# EAGLE design ssslidar_v1.0_main_board (EAGLE 7.6.0)
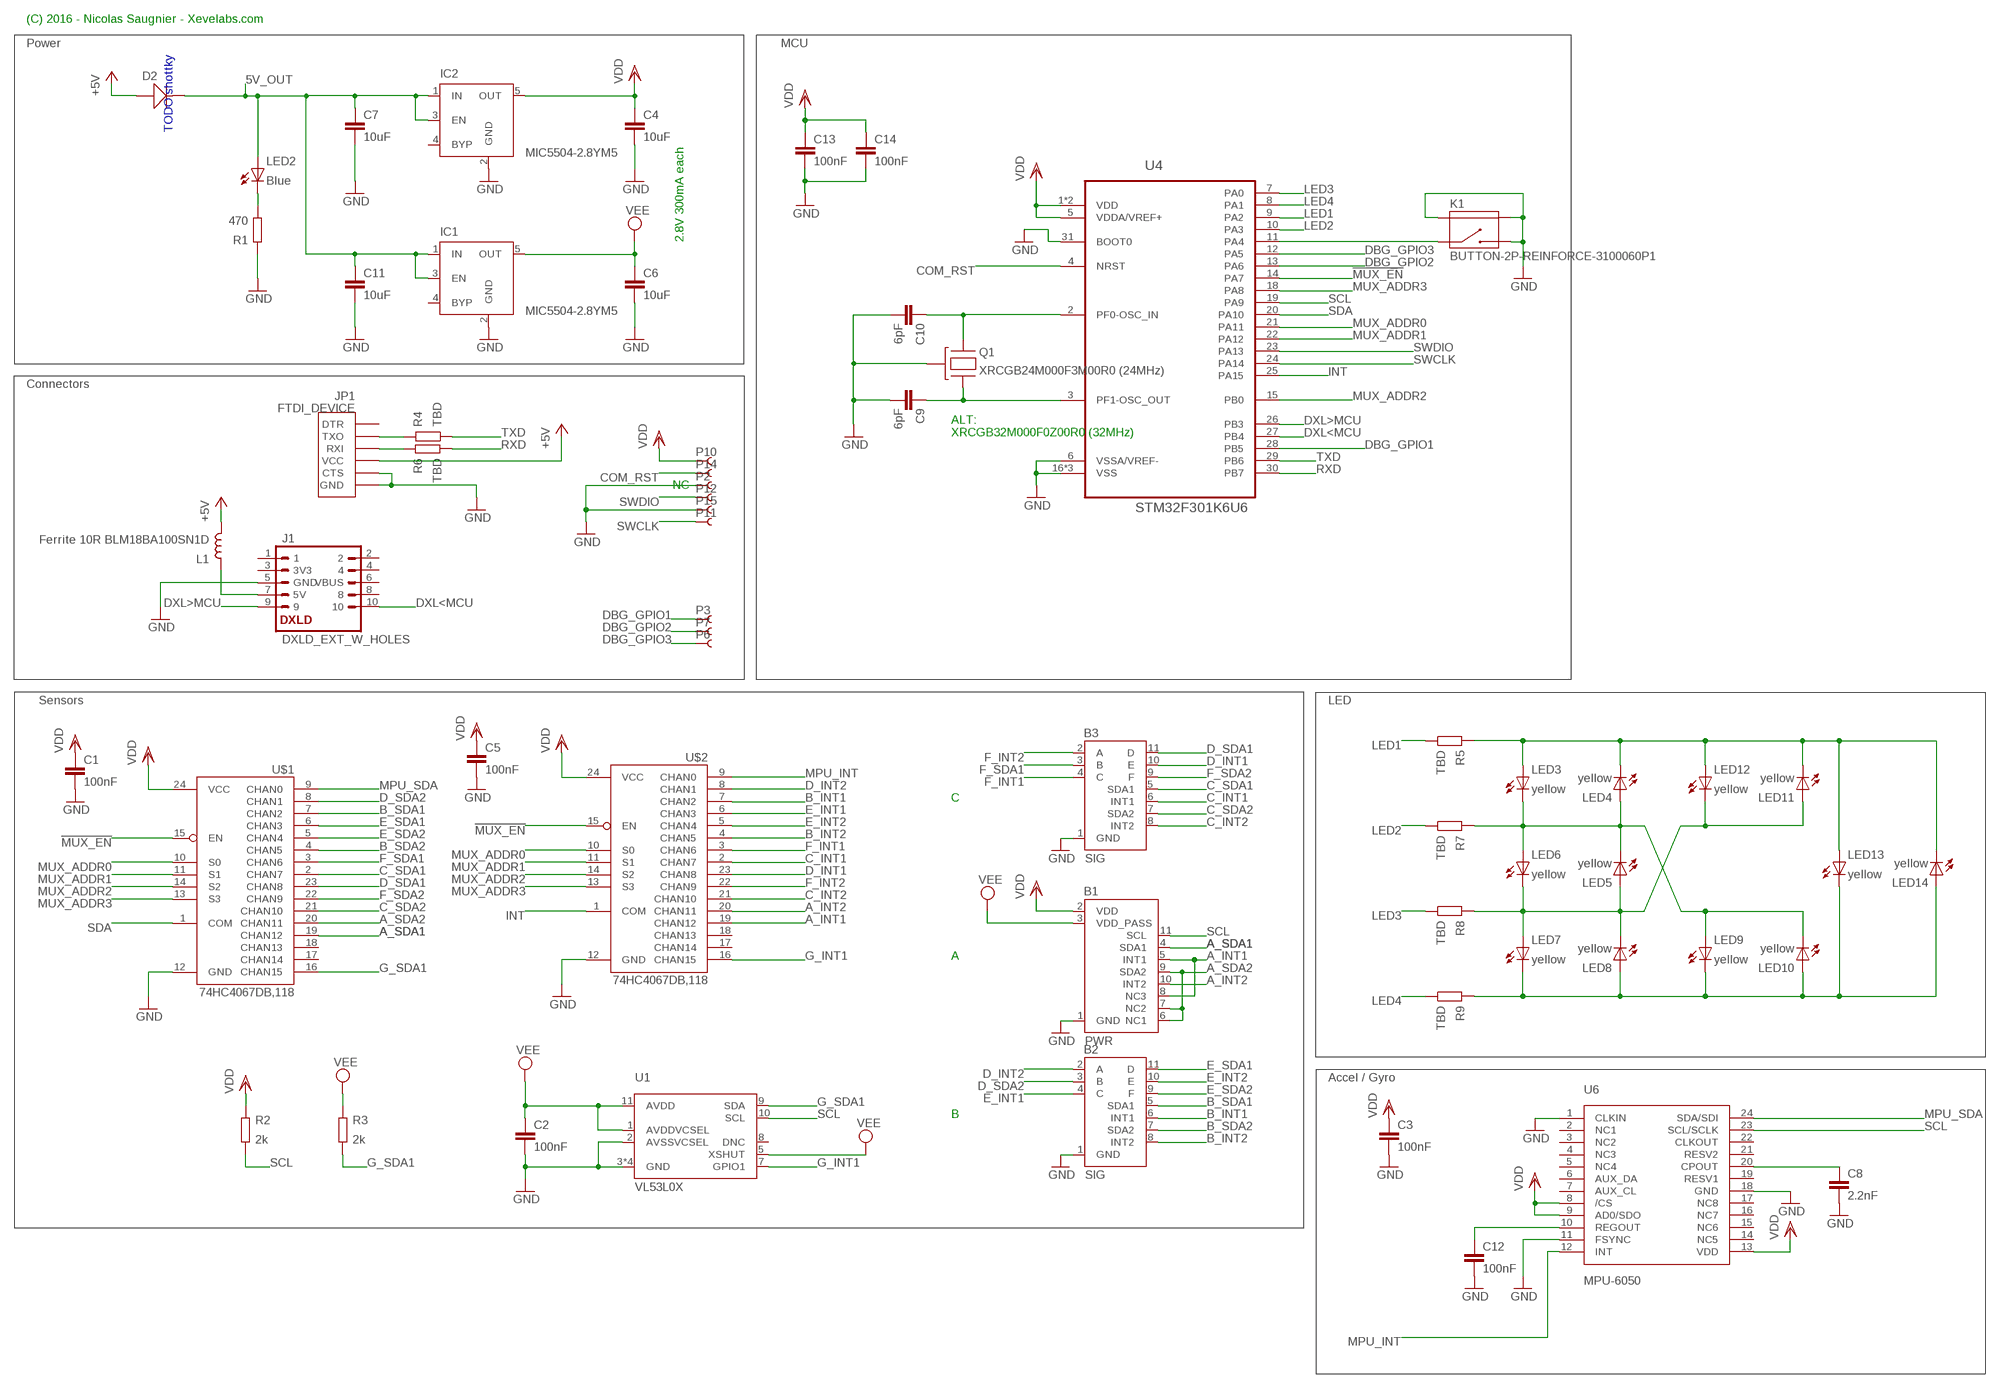
[diagram p0: schematic, sheet 1]

## Parts
B1  PWR  BLADE_PWR_BOTTOM  [BLADE]
B2  SIG  BLADE_SIG_BOTTOM  [BLADE]
B3  SIG  BLADE_SIG_BOTTOM  [BLADE]
C1  100nF  C0402  [0402_N]
C2  100nF  C0402  [0402_N]
C3  100nF  C0402  [0402_N]
C4  10uF  C0805  [0805_N]
C5  100nF  C0402  [0402_N]
C6  10uF  C0805  [0805_N]
C7  10uF  C0805  [0805_N]
C8  2.2nF  C0402  [0402_N]
C9  6pF  C0402  [0402_N]
C10  6pF  C0402  [0402_N]
C11  10uF  C0805  [0805_N]
C12  100nF  C0402  [0402_N]
C13  100nF  C0402  [0402_N]
C14  100nF  C0402  [0402_N]
D2  D-SOD-123  [SOD123]
IC1  MIC5504-2.8YM5  MIC5219XX  [SOT23-5]
IC2  MIC5504-2.8YM5  MIC5219XX  [SOT23-5]
J1  DXLD_EXT_W_HOLES  [DXLD_EXT_W_HOLES]
JP1  FTDI_DEVICE  [FTDI_DEVICE_SIDE]
K1  BUTTON-2P-REINFORCE-3100060P1  [4P-SMD-7.0X3.5X3.5H-90D]
L1  Ferrite 10R BLM18BA100SN1D  L0603  [0603_N]
LED2  Blue  LED0603  [D_0603_N]
LED3  yellow  LED0603  [D_0603_N]
LED4  yellow  LED0603  [D_0603_N]
LED5  yellow  LED0603  [D_0603_N]
LED6  yellow  LED0603  [D_0603_N]
LED7  yellow  LED0603  [D_0603_N]
LED8  yellow  LED0603  [D_0603_N]
LED9  yellow  LED0603  [D_0603_N]
LED10  yellow  LED0603  [D_0603_N]
LED11  yellow  LED0603  [D_0603_N]
LED12  yellow  LED0603  [D_0603_N]
LED13  yellow  LED0603  [D_0603_N]
LED14  yellow  LED0603  [D_0603_N]
P2  PIN_SMD_1X1.6  [PIN_SMD_1X1.6]
P3  PIN_SMD_1X1  [PIN_SMD_1X1]
P6  PIN_SMD_1X1  [PIN_SMD_1X1]
P7  PIN_SMD_1X1  [PIN_SMD_1X1]
P10  PIN_SMD_1X1.6  [PIN_SMD_1X1.6]
P11  PIN_SMD_1X1.6  [PIN_SMD_1X1.6]
P12  PIN_SMD_1X1.6  [PIN_SMD_1X1.6]
P14  PIN_SMD_1X1.6  [PIN_SMD_1X1.6]
P15  PIN_SMD_1X1.6  [PIN_SMD_1X1.6]
Q1  XRCGB24M000F3M00R0 (24MHz)  CRYSTAL_W/BODY-2.0X1.6  [CRYSTAL_2.0X1.6_4P]
R1  470  R0402  [0402_N]
R2  2k  R0402  [0402_N]
R3  2k  R0402  [0402_N]
R4  TBD  R0402  [0402_N]
R5  TBD  R0402  [0402_N]
R6  TBD  R0402  [0402_N]
R7  TBD  R0402  [0402_N]
R8  TBD  R0402  [0402_N]
R9  TBD  R0402  [0402_N]
U1  VL53L0X  [VL53L0X]
U4  STM32F301K6U6  [QFN50P500X500X60-33N]
U6  MPU-6050  MPU-6000  [QFN-24]
U$1  74HC4067DB,118  MUX-74HC4067SMD  [SSOP24]
U$2  74HC4067DB,118  MUX-74HC4067SMD  [SSOP24]

## Nets
5V_OUT: C7.1 C11.1 D2.- IC1.1(IN) IC1.3(EN) IC2.1(IN) IC2.3(EN) LED2.A
!MUX_EN: U4.14(PA7) U$1.15(EN) U$2.15(EN)
+5V: D2.+ JP1.P$4(VCC) L1.2
A_INT1: B1.5(INT1) B1.8(NC3) U$2.19(CHAN12)
A_INT2: B1.10(INT2) U$2.20(CHAN11)
A_SDA1: B1.4(SDA1) U$1.19(CHAN12)
A_SDA2: B1.6(NC1) B1.7(NC2) B1.9(SDA2) U$1.20(CHAN11)
B_INT1: B2.6(INT1) U$2.7(CHAN2)
B_INT2: B2.8(INT2) U$2.4(CHAN5)
B_SDA1: B2.5(SDA1) U$1.7(CHAN2)
B_SDA2: B2.7(SDA2) U$1.4(CHAN5)
C_INT1: B3.6(INT1) U$2.2(CHAN7)
C_INT2: B3.8(INT2) U$2.21(CHAN10)
C_SDA1: B3.5(SDA1) U$1.2(CHAN7)
C_SDA2: B3.7(SDA2) U$1.21(CHAN10)
COM_RST: P14.PIN U4.4(NRST)
D_INT1: B3.10(E) U$2.23(CHAN8)
D_INT2: B2.2(A) U$2.8(CHAN1)
D_SDA1: B3.11(D) U$1.23(CHAN8)
D_SDA2: B2.3(B) U$1.8(CHAN1)
DBG_GPIO1: P3.P$1 U4.28(PB5)
DBG_GPIO2: P7.P$1 U4.13(PA6)
DBG_GPIO3: P6.P$1 U4.12(PA5)
DXL<MCU: J1.10 U4.27(PB4)
DXL>MCU: J1.9 U4.26(PB3)
E_INT1: B2.4(C) U$2.6(CHAN3)
E_INT2: B2.10(E) U$2.5(CHAN4)
E_SDA1: B2.11(D) U$1.6(CHAN3)
E_SDA2: B2.9(F) U$1.5(CHAN4)
F_INT1: B3.4(C) U$2.3(CHAN6)
F_INT2: B3.2(A) U$2.22(CHAN9)
F_SDA1: B3.3(B) U$1.3(CHAN6)
F_SDA2: B3.9(F) U$1.22(CHAN9)
G_INT1: U1.7(GPIO1) U$2.16(CHAN15)
G_SDA1: R3.1 U1.9(SDA) U$1.16(CHAN15)
GND: B1.1(GND) B2.1(GND) B3.1(GND) C1.2 C2.2 C3.2 C4.2 C5.2 C6.2 C7.2 C8.2 C9.2 C10.2 C11.2 C12.2 C13.2 C14.2 IC1.2(GND) IC2.2(GND) J1.5(GND) JP1.P$5(CTS) JP1.P$6(GND) K1.2 K1.S1 K1.S2 P2.PIN P15.PIN Q1.2(GND) Q1.4(GND) R1.2 U1.2(AVSSVCSEL) U1.3(GND) U1.4(GND) U1.6(GND) U1.12(GND) U4.6(VSSA/VREF-) U4.16(VSS) U4.31(BOOT0) U4.32(VSS) U4.33(VSS) U6.1(CLKIN) U6.11(FSYNC) U6.18(GND) U$1.12(GND) U$2.12(GND)
INT: U4.25(PA15) U$2.1(COM)
LED1: R5.1 U4.9(PA2)
LED2: R7.1 U4.10(PA3)
LED3: R8.1 U4.7(PA0)
LED4: R9.1 U4.8(PA1)
MPU_INT: U6.12(INT) U$2.9(CHAN0)
MPU_SDA: U6.24(SDA/SDI) U$1.9(CHAN0)
MUX_ADDR0: U4.21(PA11) U$1.10(S0) U$2.10(S0)
MUX_ADDR1: U4.22(PA12) U$1.11(S1) U$2.11(S1)
MUX_ADDR2: U4.15(PB0) U$1.14(S2) U$2.14(S2)
MUX_ADDR3: U4.18(PA8) U$1.13(S3) U$2.13(S3)
N$1: C10.1 Q1.1 U4.2(PF0-OSC_IN)
N$2: C9.1 Q1.3 U4.3(PF1-OSC_OUT)
N$4: K1.1 U4.11(PA4)
N$5: J1.7(5V) L1.1
N$8: LED2.C R1.1
N$9: LED3.A LED4.C LED11.C LED12.A LED13.A LED14.C R5.2
N$10: LED3.C LED4.A LED5.C LED6.A LED9.A LED10.C R7.2
N$11: LED5.A LED6.C LED7.A LED8.C LED11.A LED12.C R8.2
N$12: LED7.C LED8.A LED9.C LED10.A LED13.C LED14.A R9.2
N$13: JP1.P$2(TXO) R4.2
N$14: JP1.P$3(RXI) R6.2
N$31: C12.1 U6.10(REGOUT)
N$33: C8.1 U6.20(CPOUT)
RXD: R6.1 U4.30(PB7)
SCL: B1.11(SCL) R2.1 U1.10(SCL) U4.19(PA9) U6.23(SCL/SCLK)
SDA: U4.20(PA10) U$1.1(COM)
SWCLK: P11.PIN U4.24(PA14)
SWDIO: P12.PIN U4.23(PA13)
TXD: R4.1 U4.29(PB6)
VDD: B1.2(VDD) C1.1 C3.1 C4.1 C5.1 C13.1 C14.1 IC2.5(OUT) P10.PIN R2.2 U4.1(VDD) U4.5(VDDA/VREF+) U4.17(VDD) U6.8(/CS) U6.9(AD0/SDO) U6.13(VDD) U$1.24(VCC) U$2.24(VCC)
VEE: B1.3(VDD_PASS) C2.1 C6.1 IC1.5(OUT) R3.2 U1.1(AVDDVCSEL) U1.5(XSHUT) U1.11(AVDD)
Unconnected: IC1.4(BYP) IC2.4(BYP) J1.1 J1.2 J1.3(3V3) J1.4 J1.6(VBUS) J1.8 JP1.P$1(DTR) U1.8(DNC) U6.2(NC1) U6.3(NC2) U6.4(NC3) U6.5(NC4) U6.6(AUX_DA) U6.7(AUX_CL) U6.14(NC5) U6.15(NC6) U6.16(NC7) U6.17(NC8) U6.19(RESV1) U6.21(RESV2) U6.22(CLKOUT) U$1.17(CHAN14) U$1.18(CHAN13) U$2.17(CHAN14) U$2.18(CHAN13)

## Notes on the sheet
- (C) 2016 - Nicolas Saugnier - Xevelabs.com
- Power | MCU
- TODO shottky
- 2.8V 300mA each
- Connectors
- ALT:
  XRCGB32M000F0Z00R0 (32MHz)
- NC
- Sensors | LED
- C
- A
- Accel / Gyro
- B

## Library data of the parts
B1 = ssslidar:BLADE_PWR_BOTTOM
B2 B3 = ssslidar:BLADE_SIG_BOTTOM
C1-C14 = Xevelabs:C: Non-polarized Capacitor
D2 = OPL:D*: DIODE
IC1 IC2 = v-reg-micrel:MIC5219XX: VOLTAGE REGULATOR; OC_FARNELL: unknown; OC_NEWARK: unknown
J1 = Xevelabs:DXLD_EXT
JP1 = SparkFun-Connectors:FTDI_DEVICE: Connector which mates to FTDI basic or FTDI cable.
K1 = OPL:BUTTON-2P-REINFORCE: TS-1188E http://www.best-dz.com/?thread-374-2.html SMD Button
L1 = Xevelabs:L
LED2-LED14 = Xevelabs:LED: LED
P2 P3 P6 P7 P10-P12 P14 P15 = Xevelabs:PIN
Q1 = Xevelabs:CRYSTAL_W/BODY: Crystal oscillator, with connection to the body.
R1-R9 = Xevelabs:R: Resistor
U1 = VL53L0X:VL53L0X: VL53L0X distance sensor
U4 = stm32F301:STM32F301K6U6: ARM-based 32-bit MCU,32UFQFN; MPN: STM32F050K4U6A; OC_FARNELL: 2115060; OC_NEWARK: 05W5798; PACKAGE: UFQFN-32; SUPPLIER: STMICROELECTRONICS
U6 = mpu6000:MPU-6000: Invensense MPU-6000: 3-axis gyro, 3-axis accel & 9-axis MotionFusion The MPU-60X0 Motion Processing Unit (MPU?) is the world?s first motion processing solution with integrated 9-axis sensor fusion for handset and tablet applications, game controllers, motion pointer remote controls, and other consumer devices. The MPU-60X0 has an embedded 3-axis MEMS gyroscope, 3-axis MEMS accelerometer and Digital Motion Processor? (DMP) hardware accelerator engine with an auxiliary I 2 C port that interfaces to third party digital sensors, such as magnetometers. Interfacing with a 3-axis magnetometer delivers a complete 9-axis sensor fusion output to the MPU?s primary I 2 C or SPI port. (SPI is available on MPU-6000 only). This combines acceleration and rotational motion plus heading information into a single data stream for the application; DATASHEET: http://invensense.com/mems/gyro/documents/PS-MPU-6000A-00_v1.0.pdf; LINK: http://invensense.com/mems/gyro/mpu6000.html; MFGPN: MPU-6000
U$1 U$2 = SparkFun-AnalogIC:MUX-74HC4067: 16-channel analog MUX

## Board
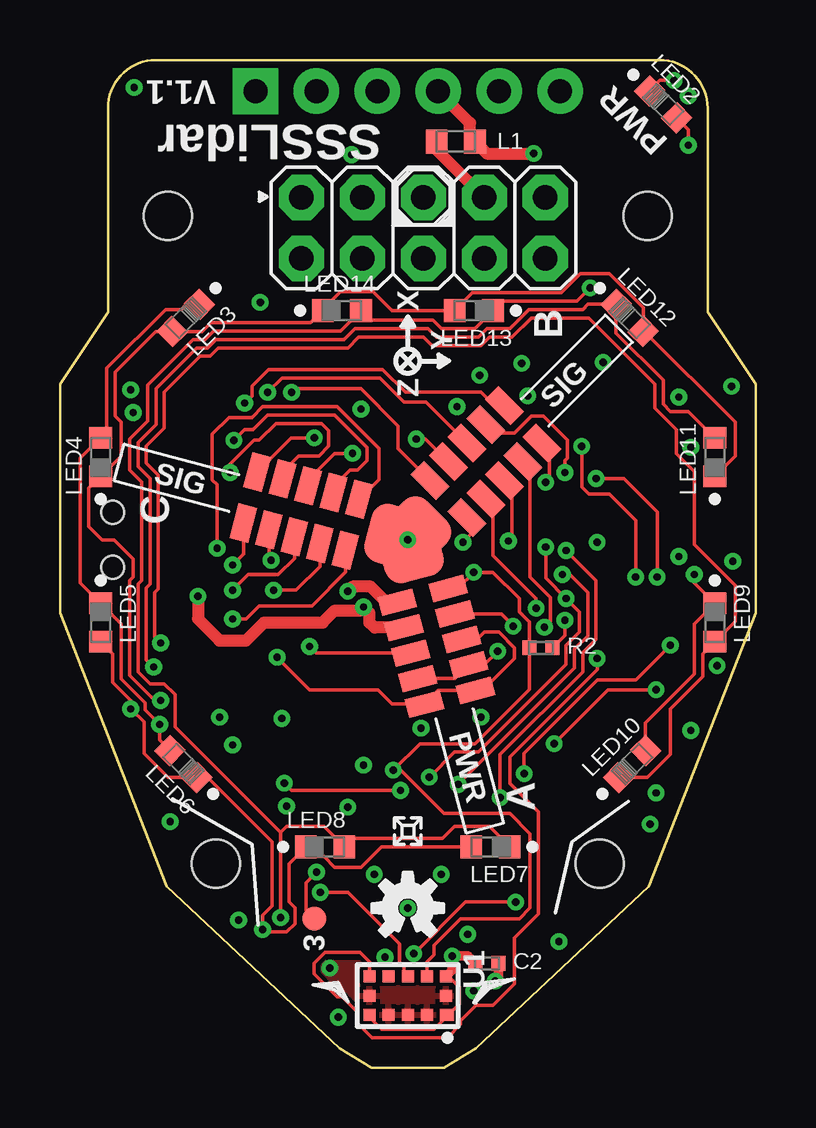
[diagram p1: board, top side]
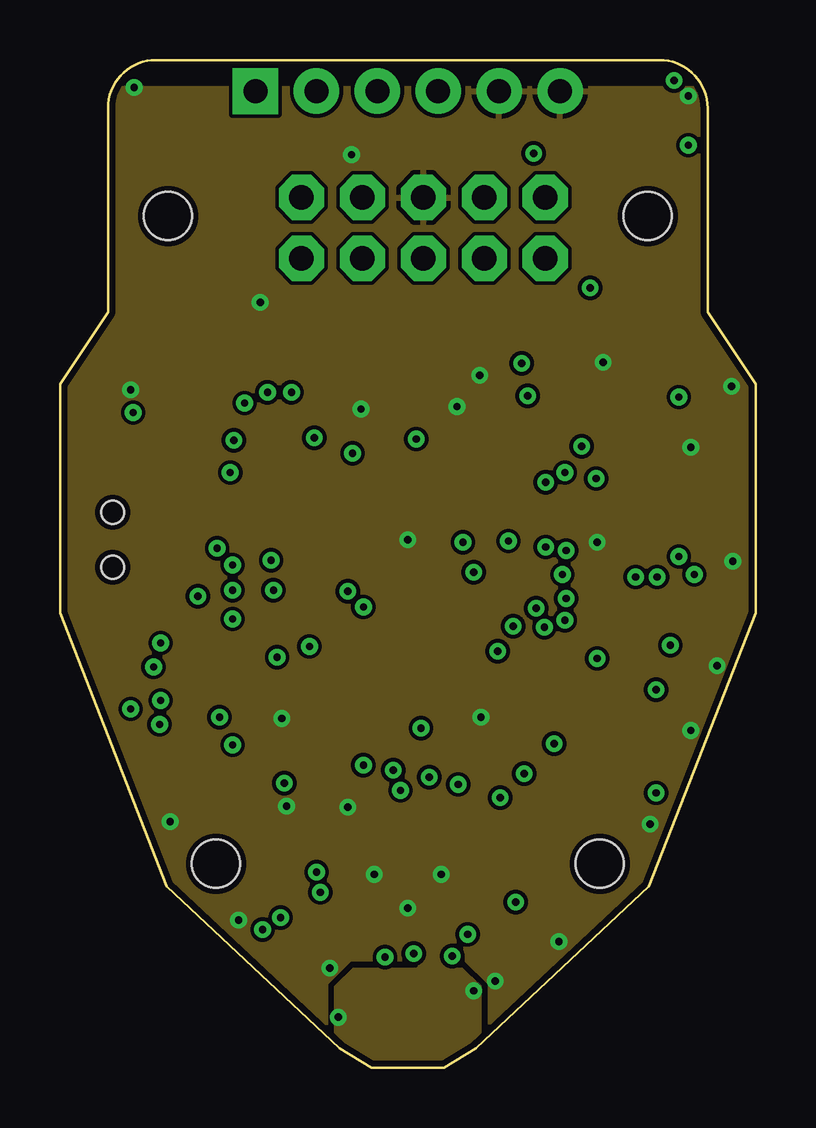
[diagram p2: board, inner layer Route2]
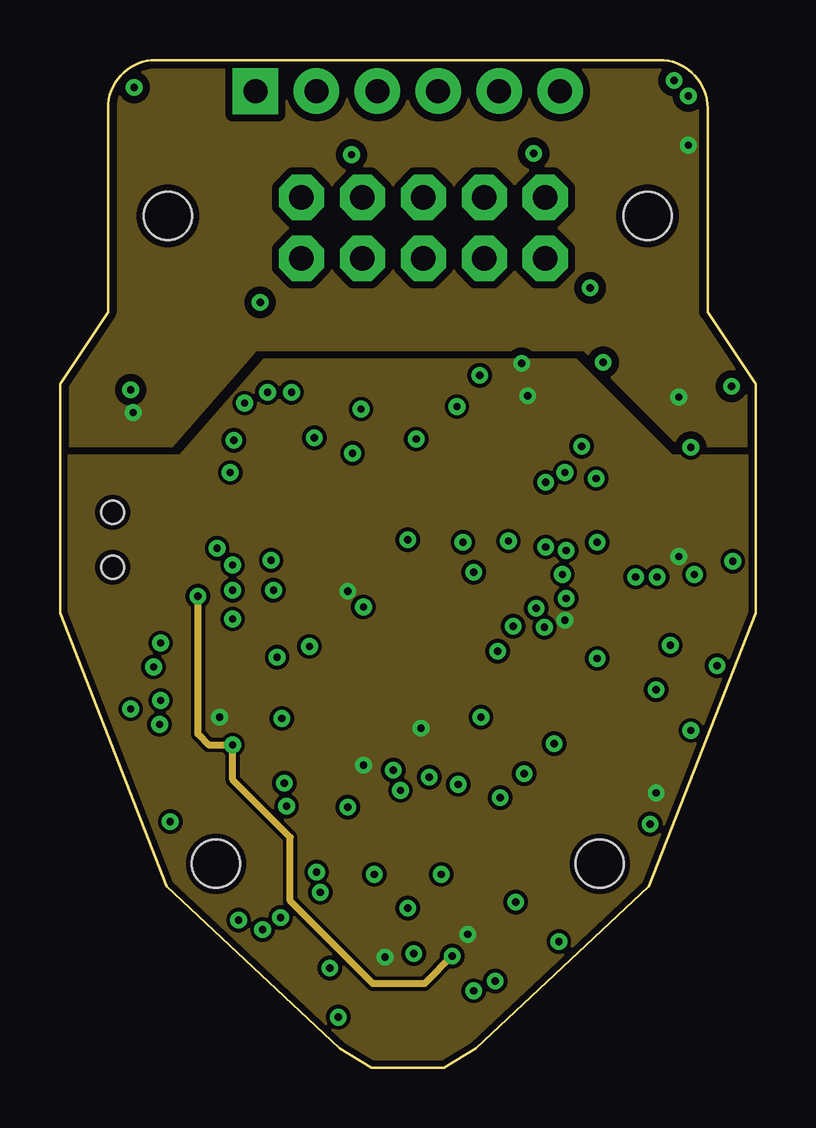
[diagram p3: board, inner layer Route3]
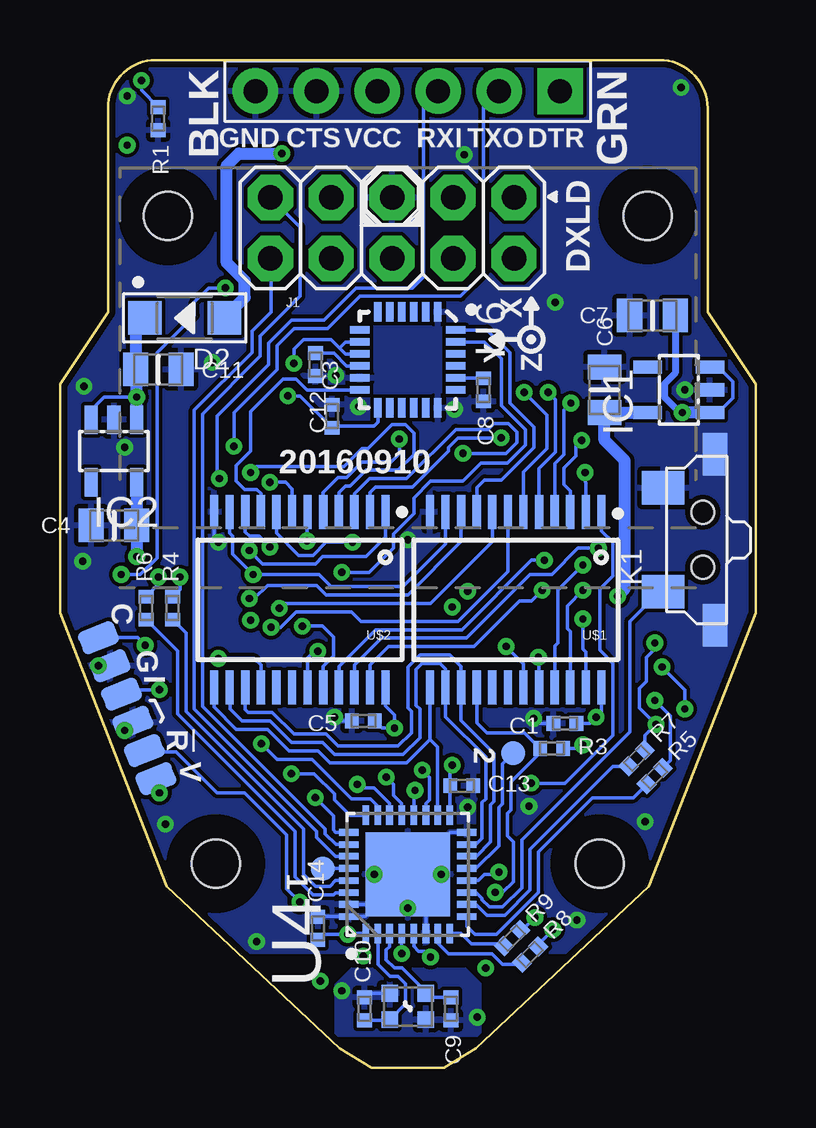
[diagram p4: board, bottom side, seen from below]

Size 29 x 42 mm. Coordinates in mm from the lower left corner, seen from the top.
Outline: 2,31.5 0,28.5 0,18.95 4.45,7.55 11.65,0.8 13,0 16,0 17.35,0.8 24.55,7.55 29,18.95 29,28.5 27,31.5 27,40 arc90 25,42 4,42 arc90 2,40 2,31.5
Copper layers (1*2*3*16): Top 0.035mm / dielectric 0.15mm / Route2 0.035mm / dielectric 1.1mm / Route3 0.035mm / dielectric 0.15mm / Bottom 0.035mm
Design rules "Xevelabs_6mil_4layers_eurocircuits *": minimum track width 0.15mm, minimum drill 0.25mm, track to track 0.155mm, track to pad 0.155mm, pad to pad 0.155mm, via to via 0.155mm, smd to smd 0mil, copper to edge 0.25mm, drill to drill 0.25mm, minimum pad ring 0.15mm, minimum via ring 0.2mm, stop-mask expansion 0mil, vias tented up to drill 100mil, thermal gap 0.2mm
Holes 2 mm at 6.5,8.5 22.5,8.5
tKeepout: area 4.5,6.5 to 8.5,10.5; area 20.5,6.5 to 24.5,10.5
bKeepout: area 3.5,5.5 to 9.5,11.5; area 19.5,5.5 to 25.5,11.5; area 1.5,32.5 to 7.5,38.5; area 21.5,32.5 to 27.5,38.5
bRestrict: area 22.5,33.5 to 26.5,37.5; area 4.5,6.5 to 8.5,10.5; area 20.5,6.5 to 24.5,10.5; area 2.5,33.5 to 6.5,37.5

### Footprints (pad centres in the part's own frame; a part is rotated, then mirrored left to right if it is on the bottom)
BLADE = smd 1.7 x 2.5: 1 0.85,0 | smd 0.8 x 1.5: 2 2.4,-1.1; 3 3.5,-1.1; 4 4.6,-1.1; 5 5.7,-1.1; 6 6.8,-1.1; 7 6.8,1.1; 8 5.7,1.1; 9 4.6,1.1; 10 3.5,1.1; 11 2.4,1.1
0402_N = smd 0.57 x 0.62: 1 -0.48,0; 2 0.48,0
0805_N = smd 1.05 x 1.4: 1 -0.95,0; 2 0.95,0
SOD123 = smd 1.397 x 1.397: + -1.651,0; - 1.651,0
SOT23-5 = smd 0.55 x 1.2: 1 -0.95,-1.3; 2 0,-1.3; 3 0.95,-1.3; 4 0.95,1.3; 5 -0.95,1.3
DXLD_EXT_W_HOLES = drill 1.016 pad 1.88 octagon: 1 -0.77,4.43; 2 1.77,4.43; 3 -0.77,1.89; 4 1.77,1.89; 5 -0.77,-0.65; 6 1.77,-0.65; 7 -0.77,-3.19; 8 1.77,-3.19; 9 -0.77,-5.73; 10 1.77,-5.73 | hole 2: 0,10; 0,-10
FTDI_DEVICE_SIDE = drill 1 pad 1.9 square: P$1 -6.35,0 | drill 1 pad 1.9: P$2 -3.81,0; P$3 -1.27,0; P$4 1.27,0; P$5 3.81,0; P$6 6.35,0
4P-SMD-7.0X3.5X3.5H-90D = smd 1.397 x 1.778: 1 -2.159,1.651; 2 2.159,1.651 | smd 1.778 x 1.016: S1 -3.556,-0.508; S2 3.556,-0.508 | hole 0.95: -1.15,0; 1.15,0
0603_N = smd 0.9 x 1: 1 -0.8,0; 2 0.8,0
D_0603_N = smd 0.9 x 0.95: A 0.8,0; C -0.8,0
PIN_SMD_1X1.6 = smd 1.6 x 1: PIN 0,0
PIN_SMD_1X1 = smd 1 x 1: P$1 0,0
CRYSTAL_2.0X1.6_4P = smd 0.7 x 0.7: 1 -0.75,-0.55; 2 0.75,-0.55; 3 0.75,0.55; 4 -0.75,0.55
VL53L0X = smd 0.5 x 0.58: 1 0.8,1.64 | smd 0.5 x 0.5: 2 0.8,0.8; 3 0.8,0; 4 0.8,-0.8; 5 0.8,-1.6; 6 0,-1.6; 7 -0.8,-1.6; 8 -0.8,-0.8; 9 -0.8,0; 10 -0.8,0.8; 11 -0.8,1.6; 12 0,1.6
QFN50P500X500X60-33N = smd 0.813 x 0.279: 1 -2.464,1.753; 2 -2.464,1.245; 3 -2.464,0.762; 4 -2.464,0.254; 5 -2.464,-0.254; 6 -2.464,-0.762; 7 -2.464,-1.245; 8 -2.464,-1.753; 17 2.464,-1.753; 18 2.464,-1.245; 19 2.464,-0.762; 20 2.464,-0.254; 21 2.464,0.254; 22 2.464,0.762; 23 2.464,1.245; 24 2.464,1.753 | smd 0.279 x 0.813: 9 -1.753,-2.464; 10 -1.245,-2.464; 11 -0.762,-2.464; 12 -0.254,-2.464; 13 0.254,-2.464; 14 0.762,-2.464; 15 1.245,-2.464; 16 1.753,-2.464; 25 1.753,2.464; 26 1.245,2.464; 27 0.762,2.464; 28 0.254,2.464; 29 -0.254,2.464; 30 -0.762,2.464; 31 -1.245,2.464; 32 -1.753,2.464 | smd 3.505 x 3.505: 33 0,0
QFN-24 = smd 0.8 x 0.3: 1 -2,1.25; 2 -2,0.75; 3 -2,0.25; 4 -2,-0.25; 5 -2,-0.75; 6 -2,-1.25; 13 2,-1.25; 14 2,-0.75; 15 2,-0.25; 16 2,0.25; 17 2,0.75; 18 2,1.25 | smd 0.3 x 0.8: 7 -1.25,-2; 8 -0.75,-2; 9 -0.25,-2; 10 0.25,-2; 11 0.75,-2; 12 1.25,-2; 19 1.25,2; 20 0.75,2; 21 0.25,2; 22 -0.25,2; 23 -0.75,2; 24 -1.25,2
SSOP24 = smd 0.348 x 1.397: 1 -3.575,-3.656; 2 -2.925,-3.656; 3 -2.275,-3.656; 4 -1.625,-3.656; 5 -0.975,-3.656; 6 -0.325,-3.656; 7 0.325,-3.656; 8 0.975,-3.656; 9 1.625,-3.656; 10 2.275,-3.656; 11 2.925,-3.656; 12 3.575,-3.656; 13 3.575,3.656; 14 2.925,3.656; 15 2.275,3.656; 16 1.625,3.656; 17 0.975,3.656; 18 0.325,3.656; 19 -0.325,3.656; 20 -0.975,3.656; 21 -1.625,3.656; 22 -2.275,3.656; 23 -2.925,3.656; 24 -3.575,3.656

### Placement (x,y rotation side)
B1  14.5,22 285 top
B2  14.5,22 45 top
B3  14.5,22 165 top
C1  7.95,14.35 180 bottom
C2  17.8,4.35 0 top
C3  17.65,27.15 90 bottom
C4  26.75,22.6 180 bottom
C5  16.35,14.45 180 bottom
C6  6.3,28.25 90 bottom
C7  4.3,31.35 180 bottom
C8  11.35,28.25 270 bottom
C9  12.7,2.45 270 bottom
C10  16.3,2.45 90 bottom
C11  24.9,29.1 0 bottom
C12  18.35,29.3 270 bottom
C13  12.25,11.75 0 bottom
C14  18.25,5.8 90 bottom
D2  23.8,31.25 180 bottom
IC1  3.2,28.25 90 bottom
IC2  26.75,25.7 180 bottom
J1  14.5,35.5 270 bottom
JP1  14.5,40.7 180 bottom
K1  2.2,22 90 bottom
L1  16.5,38.6 0 top
LED2  25.15,40.15 315 top
LED3  5.25,31.25 225 top
LED4  1.7,25.45 90 top
LED5  1.7,18.55 270 top
LED6  5.15,12.65 135 top
LED7  17.95,9.2 180 top
LED8  11.05,9.2 0 top
LED9  27.3,18.55 270 top
LED10  23.85,12.65 45 top
LED11  27.3,25.45 90 top
LED12  23.75,31.25 315 top
LED13  17.25,31.55 180 top
LED14  11.75,31.55 0 top
P2  25.96,14.39 22 bottom
P3  18.05,8.3 90 bottom
P6  10.6,6.2 90 top
P7  10.1,13.1 90 bottom
P10  25.01,12.03 22 bottom
P11  27.39,17.92 22 bottom
P12  26.44,15.56 22 bottom
P14  25.49,13.21 22 bottom
P15  26.91,16.74 22 bottom
Q1  14.5,2.55 0 bottom
R1  24.9,39.55 270 bottom
R2  20.05,17.5 0 top
R3  8.5,13.3 0 bottom
R4  24.3,19.15 90 bottom
R5  4.2,12.15 45 bottom
R6  25.4,19.15 90 bottom
R7  4.95,12.9 45 bottom
R8  9.4,4.7 45 bottom
R9  10.15,5.4 45 bottom
U1  14.5,3 270 top
U4  14.5,8.05 90 bottom
U6  14.5,29.5 270 bottom
U$1  10,19.5 180 bottom
U$2  19,19.5 180 bottom
U$3  [XEVELABS_LOGO_S]  14.45,9.8 0 top
U$4  [OSHW-LOGO-S]  14.5,6.65 0 top

### Tracks (layer width: path | path; a pad name or v marks a point on that pad's centre or on a via)
5V_OUT  (via drill 0.3)
  Top 0.15: LED2.A 26.2,39.1 v26.2,38.45
  Bottom 0.15: IC2.3 27.7,27.4 27.15,27.95 v25.8,27.95 | IC1.3 1.55,29.2 0.95,28.6 0.95,27.9 1.55,27.3 IC1.1
  Bottom 0.3: C7.1 3.35,28.95 3.8,28.5 3.8,27.95 3.15,27.3
  Bottom 0.406: v3.05,27.3 3.15,27.3
  Bottom 0.5: IC2.1 v25.8,27.95 25.8,29.05 C11.1 25.85,30.85 D2.- | IC1.1 v3.05,27.3
  pour Route3 (isolate 0.3, rank 3): 0.8,42.1 31.25,42.4 29.55,25.5 -0.4,25.5 -0.35,41.95
!MUX_EN
  Bottom 0.15: U$2.15 21.27,14.93 21.15,14.8 20.15,14.8 19.25,13.9 17.9,13.9 17.4,13.4 14.9,13.4 14.35,13.95 14.35,14.85 14.5,15 14.5,16.7 14,17.2 12.75,17.2 12.28,16.73 U$1.15 12.28,14.47 10.9,13.1 10.9,11.1 11.05,10.95 11.05,9.4 11.64,8.81 U4.14
+5V  (via drill 0.3)
  Top 0.5: JP1.P$4 17.1,39.37 17.1,38.8 L1.2 17.8,38.1 v19.75,38.1
  Bottom 0.5: D2.+ 21.3,32.1 21.3,32.8 22.05,33.55 22.05,37.6 21.55,38.1 v19.75,38.1
A_INT1  (via drill 0.3)
  Top 0.15: B1.5 16.47,16.21 B1.8 17.68,16.78 v18.25,17.35
  Bottom 0.15: U$2.19 18.68,17.07 18.4,17.35 v18.25,17.35
A_INT2  (via drill 0.3)
  Top 0.15: B1.10 18.4,18.9 v18.9,18.4
  Bottom 0.15: U$2.20 18.02,16.73 17.6,17.15 17.6,17.95 18.05,18.4 v18.9,18.4
A_SDA1  (via drill 0.3)
  Top 0.15: B1.4 10.68,17.27 v10.4,17.55
  Bottom 0.15: U$1.19 9.68,16.82 v10.4,17.55
A_SDA2  (via drill 0.3)
  Top 0.15: v9.05,17.1 10.4,15.75 13.25,15.75 13.85,15.15 B1.6 15.77,15.72 B1.7 17.62,15.72 18.95,17.05 18.95,17.5 18.3,18.15 17.7,18.15 17.39,17.84 B1.9
  Bottom 0.15: U$1.20 9.03,17.07 v9.05,17.1
B_INT1  (via drill 0.3)
  Top 0.15: v20.25,24.4 20.4,24.55 20.4,25.35 20.09,25.66 B2.6
  Bottom 0.15: U$2.7 19.32,24.12 19.6,24.4 v20.25,24.4
B_INT2  (via drill 0.3)
  Top 0.15: 21.05,25.25 v21.05,24.8 21.05,25.3 21.15,25.4 21.15,26.15 20.15,27.15 19.65,27.15 18.95,26.45 18.11,26.45 B2.8
  Bottom 0.15: U$2.4 17.38,23.98 17.1,24.25 16.9,24.25 16.25,24.9 14.9,24.9 14.25,25.55 14.25,26.45 14.6,26.8 15.15,26.8 16.15,25.8 16.4,25.8 17.15,25.05 20.8,25.05 v21.05,24.8
B_SDA1  (via drill 0.3)
  Top 0.15: v20.2,18.35 20.45,18.6 20.45,19.6 19.6,20.45 19.6,24.96 B2.5
  Bottom 0.15: U$1.7 10.32,20.68 12.4,18.6 16.45,18.6 16.85,19 19.15,19 19.8,18.35 v20.2,18.35
B_SDA2  (via drill 0.3)
  Top 0.15: v7.7,27.7 8,28 8,28.4 8.7,29.1 13.45,29.1 14.4,28.15 17.55,28.15 18.11,27.59 B2.7
  Bottom 0.15: U$1.4 8.38,25.18 8,25.55 8,27.4 v7.7,27.7
C_INT1  (via drill 0.3)
  Top 0.15: v10.6,26.25 9.64,26.25 B3.6
  Bottom 0.15: U$2.2 16.07,23.98 15.85,24.2 14.3,24.2 12.8,25.7 12.8,25.85 12.4,26.25 v10.6,26.25
C_INT2  (via drill 0.3)
  Top 0.15: B3.8 8.71,21.24 v8.8,21.15
  Bottom 0.15: U$2.21 17.38,16.73 15.85,18.25 12.25,18.25 9.35,21.15 v8.8,21.15
C_SDA1  (via drill 0.3)
  Top 0.15: B3.5 9.28,24.83 9.95,25.5 10.8,25.5 11.2,25.9 11.2,26.55 10.9,26.85 9,26.85 8.3,26.15 8.1,26.15 7.1,25.15 v7.1,24.8
  Bottom 0.15: U$1.2 7.08,24.38 7.1,24.4 v7.1,24.8
C_SDA2  (via drill 0.3)
  Top 0.15: B3.7 7.65,21.4 v7.2,20.95
  Bottom 0.15: v7.2,20.95 8.25,19.9 8.25,17.7 8.38,17.57 U$1.21
COM_RST  (via drill 0.3)
  Top 0.15: v14.75,4.75 16.9,6.9 v19,6.9
  Bottom 0.15: U4.4 v14.75,4.75 | v19,6.9 19.55,7.45 19.55,9.7 21.3,11.45 22.45,11.45 24.15,13.15 25.43,13.15 P14.PIN
D_INT1  (via drill 0.3)
  Top 0.15: v8.9,19.9 9.85,19.9 10.84,20.89 B3.10
  Bottom 0.15: v8.9,19.9 9.35,19.45 9.85,19.45 11.75,17.55 15.3,17.55 16.07,16.77 U$2.23
D_INT2  (via drill 0.3)
  Top 0.15: v16.8,21.9 17.2,22.3 17.2,22.35 16.98,22.57 B2.2
  Bottom 0.15: U$2.8 19.98,22.27 19.05,21.35 18.45,21.35 17.9,21.9 v16.8,21.9
D_SDA1  (via drill 0.3)
  Top 0.15: v7.2,18.7 7.75,18.7 8.3,19.25 10.5,19.25 11.9,20.65 B3.11
  Bottom 0.15: U$1.23 7.08,17.32 7.2,17.45 v7.2,18.7
D_SDA2  (via drill 0.3)
  Top 0.15: v19.85,19.15 19.85,19.55 18.05,21.35 18.05,23.2 17.75,23.5 B2.3
  Bottom 0.15: U$1.8 10.97,21.93 13.55,19.35 19.65,19.35 v19.85,19.15
DBG_GPIO1
  Bottom 0.15: P3.P$1 U4.28
DBG_GPIO2
  Bottom 0.15: U4.13 11.65,8.3 10.7,9.25 10.7,10.85 10.55,11 10.55,12.65 P7.P$1
DBG_GPIO3  (via drill 0.3)
  Top 0.15: v10.7,8.15 10.25,7.7 10.25,6.55 P6.P$1
  Bottom 0.15: U4.12 11.55,7.8 11.3,8.05 10.8,8.05 v10.7,8.15
DXL<MCU
  Bottom 0.15: U4.27 17.51,8.81 18.3,9.6 18.3,9.85 23.4,14.95 23.4,27.4 21,29.8 21,30.7 20.2,31.5 20.2,33.7 J1.10
DXL>MCU
  Bottom 0.15: U4.26 17.5,9.29 17.95,9.75 17.95,9.95 23.05,15.05 23.05,27.25 20.65,29.65 20.65,30.5 19,32.15 19,35.04 J1.9
E_INT1  (via drill 0.3)
  Top 0.15: v18.7,21.95 18.85,22.1 18.85,23.8 18.53,24.12 B2.4
  Bottom 0.15: U$2.6 18.7,23.13 v18.7,21.95
E_INT2  (via drill 0.3)
  Top 0.15: v14.85,26.2 15.25,26.2 B2.10
  Bottom 0.15: U$2.5 18.02,23.98 17.4,24.6 17.05,24.6 16.4,25.25 15.2,25.25 14.85,25.6 v14.85,26.2
E_SDA1  (via drill 0.3)
  Top 0.15: v9.65,28.15 9.8,28.3 12.55,28.3 14.1,26.75 14.1,25.79 B2.11
  Bottom 0.15: U$1.6 9.68,24.82 8.7,25.8 8.7,27.2 v9.65,28.15
E_SDA2  (via drill 0.3)
  Top 0.15: v8.65,28.15 9.25,28.75 13.34,28.75 14.34,27.75 15.26,27.75 B2.9
  Bottom 0.15: U$1.5 9.03,24.98 8.35,25.65 8.35,27.85 v8.65,28.15
F_INT1  (via drill 0.3)
  Top 0.15: v12.2,25.6 11.45,25.6 10.5,24.65 10.5,24.41 B3.4
  Bottom 0.15: U$2.3 16.73,23.93 16.1,24.55 14.55,24.55 12.5,26.6 11.15,26.6 10.9,26.85 10.3,26.85 9.95,26.5 9.95,26.05 10.4,25.6 v12.2,25.6
F_INT2  (via drill 0.3)
  Top 0.15: B3.2 13.3,24.52 13.3,25.8 11.55,27.55 8.45,27.55 8,27.1 7.05,27.1 6.35,26.4 6.35,24.5 6.55,24.3 v6.55,21.65
  Bottom 0.15: U$2.22 16.73,16.77 15.6,17.9 12.05,17.9 9.4,20.55 8.5,20.55 7.4,21.65 v6.55,21.65
F_SDA1  (via drill 0.3)
  Top 0.15: B3.3 11.4,24.2 12.1,24.9 12.4,24.9 12.8,25.3 12.8,25.85 11.45,27.2 8.65,27.2 8.05,26.6 7.7,26.6 v7.25,26.15
  Bottom 0.15: U$1.3 7.72,24.02 8,24.3 8,25 7.5,25.5 7.5,25.9 v7.25,26.15
F_SDA2  (via drill 0.3)
  Top 0.15: v7.2,19.9 7.85,20.55 9.1,20.55 9.77,21.22 B3.9
  Bottom 0.15: U$1.22 7.72,18.18 7.85,18.3 7.85,19.25 v7.2,19.9
G_INT1  (via drill 0.3)
  Top 0.15: U1.7 12.9,4.4 12.5,4.8 11.05,4.8 10.6,4.35 10.6,3.9 11.55,2.95 11.75,2.95 12.4,2.3 12.4,1.85 13,1.25 16.15,1.25 16.7,1.8 16.7,1.95 17.35,2.6 18.05,2.6 18.95,3.5 18.95,5.4 19.95,6.4 19.95,10.65 18.75,11.85 18.75,12.95 22.4,16.6 v22.4,17.05
  Bottom 0.15: U$2.16 20.62,16.77 20.9,17.05 v22.4,17.05
G_SDA1  (via drill 0.3)
  Top 0.15: U1.9 14.5,3.85 14.35,4 14.35,4.2 14.15,4.4 14.15,5.15 12,7.3 v10.85,7.3
  Bottom 0.15: U$1.16 11.62,14.38 11.2,13.95 9.63,13.95 R3.1 8.98,13.12 10.2,11.9 10.2,10.75 10.35,10.6 10.35,9.65 10.1,9.4 10.1,7.75 10.55,7.3 v10.85,7.3
GND  (via drill 0.3)
  Top 0.15: v14.5,22 14.37,22.13 13.77,22.13 B3.1 | v14.5,22 14.63,21.87 14.63,21.52 14.72,21.43 B1.1 | B2.1 v14.5,22
  Top 0.4: C2.2 18.28,3.73 v18.15,3.6
  Bottom 0.15: U4.6 13.74,7.29 U4.33 | U4.31 15.75,6.8 U4.33 | U4.33 16.25,6.3 U4.32 18.23,6.3 C14.2 | U4.16 12.75,9.8 U4.33 | C10.2 16.13,3.1 Q1.4 | U$1.12 | U$2.12 22.57,22.07 v22.4,21.9 | C1.2 9.05,14.35 v9.25,14.55 | C5.2 17.4,14.45 v17.55,14.6
  other vias: 17.25,3.2 11.6,2.1 12.15,38.05 11.25,4.15 12,10.85 26.3,14.05 27.4,16.75 26.3,25.85 2.95,28.25 8.35,31.9 3.1,40.85 26.2,40.5 28,28.4 28.05,21.1 4.6,10.25 7.45,6.15 20.8,5.25 24.6,10.15 9.45,10.9 14.5,6.65 15.9,8.05 13.1,8.05 16.55,27.55 17.5,28.85 12.55,27.45 22.65,29.4
  pour Route2: -3.3,40.8 -3.3,-2.7 32.9,-2.7 32.9,40.8
  pour Bottom: 11.5,1.35 17.5,1.35 17.5,3.45 16.85,4.1 12.1,4.1 11.5,3.5
  pour Top: 10.95,4.4 10.95,2.75 12.3,2.75 12.3,1.95 12.6,1.65 16.7,1.6 16.7,4.4
  pour Bottom (rank 4): -1.8,43.05 -1.8,4.8 29.05,4.8 29.05,43.05
INT  (via drill 0.3)
  Top 0.15: v21.1,21.55 22.35,20.3 22.35,17.85 21.8,17.3 21.8,16.5 18.35,13.05 v18.35,11.25
  Bottom 0.15: U$2.1 15.43,22.12 16.25,21.3 18.05,21.3 18.35,21 20.55,21 v21.1,21.55 | U4.25 17.5,9.8 17.6,9.9 17.6,10.5 v18.35,11.25
LED1
  Bottom 0.15: U4.9 12.04,5.89 11.7,5.55 10.8,5.55 9.05,7.3 9.05,9 6.8,11.25 5.1,11.25 R5.1
LED2
  Bottom 0.15: U4.10 11.65,6.8 11.2,6.35 10.45,6.35 9.4,7.4 9.4,9.1 5.94,12.56 R7.1
LED3
  Bottom 0.15: U4.7 13.26,5.21 12.8,4.75 11,4.75 10.55,4.3 9.8,4.3 R8.1 9.83,4.45
LED4
  Bottom 0.15: U4.8 12.29,5.59 11.85,5.15 10.58,5.15 R9.1
MPU_INT
  Bottom 0.15: U$2.9 20.62,23.93 20.8,24.1 21.3,24.1 21.65,24.45 21.65,25.1 21.05,25.7 21.05,27.35 19.7,28.7 19.15,28.7 18.7,28.25 U6.12
MPU_SDA
  Bottom 0.15: U$1.9 11.62,24.18 11.3,24.5 10.6,24.5 9.25,25.85 9.25,26.7 10.25,27.7 10.25,29.8 11.2,30.75 U6.24
MUX_ADDR0  (via drill 0.3)
  Top 0.15: v20.25,21.7 20.25,20.4 v21.1,19.55 21.65,19 21.65,18.15 21.1,17.6 21.1,16.8 17.45,13.15 16.45,13.15 v15.4,12.1
  Bottom 0.15: U$1.10 12.28,21.93 14.5,19.7 17.9,19.7 18.3,20.1 20.35,20.1 20.9,19.55 v21.1,19.55 | U4.21 14.75,11 15.1,11.35 15.1,11.8 v15.4,12.1 | U$2.10 21.27,22.32 21.1,22.15 20.7,22.15 v20.25,21.7
MUX_ADDR1  (via drill 0.3)
  Top 0.15: v20.95,20.55 21.25,20.55 22,19.8 22,18 21.45,17.45 21.45,16.65 v16.6,11.8
  Bottom 0.15: U$1.11 12.93,21.82 14.7,20.05 17.7,20.05 18.2,20.55 v20.95,20.55 21.8,21.4 21.8,22.15 21.93,22.27 U$2.11 | U4.22 15.26,11.01 15.9,11.65 16.45,11.65 v16.6,11.8
MUX_ADDR2
  Bottom 0.15: U$2.14 21.9,15.82 21.9,14.95 21.4,14.45 20.25,14.45 19.35,13.55 18.05,13.55 17.55,13.05 14.7,13.05 14,13.75 14,14.95 14.15,15.1 14.15,16.6 13.9,16.85 13.15,16.85 12.93,16.62 U$1.14 12.93,14.62 11.25,12.95 11.25,11.2 11.4,11.05 11.4,9.55 11.65,9.3 U4.15
MUX_ADDR3
  Bottom 0.15: U$1.13 13.57,13.68 | U$2.13 22.57,15.02 21.65,14.1 20.35,14.1 19.45,13.2 18.25,13.2 17.75,12.7 14.55,12.7 13.57,13.68 | U4.18 13.26,13.36 13.57,13.68
N$1
  Bottom 0.15: C10.1 15.28,1.97 Q1.1 14.6,2.65 14.6,3.5 14.9,3.8 15.25,3.8 15.75,4.29 U4.2
N$2
  Bottom 0.15: C9.1 13.58,2.93 Q1.3 13.75,3.15 14.75,4.15 15.05,4.15 15.4,4.5 15.4,4.9 15.26,5.04 U4.3 15.26,5.14
N$4
  Bottom 0.15: U4.11 11.64,7.29 11.4,7.05 11.4,7 11.1,6.7 10.55,6.7 9.75,7.5 9.75,9.5 5.25,14 5.25,18.6 4.01,19.84 K1.1
N$5
  Top 0.5: J1.7 15.7,38.26 L1.1
N$7
  cutout Route2: 14.85,4.25 12.2,4.25 11.35,3.4 11.35,1.35 11.25,1.35 11.25,3.45 12.15,4.35 14.85,4.35
  cutout Route2: 16.25,4.25 16.8,4.25 17.65,3.4 17.65,1.35 17.75,1.35 17.75,3.45 16.85,4.35 16.25,4.35
N$8  (via drill 0.3)
  Top 0.15: LED2.C 25.02,41.15 v25.6,41.15
  Bottom 0.15: R1.1 25.6,40.73 v25.6,41.15
N$9  (via drill 0.3)
  Top 0.15: LED12.A 24.32,31.68 22.9,33.1 21.7,33.1 20.9,32.3 17.2,32.3 LED13.A 13.85,31.55 13.05,32.35 11.7,32.35 10.95,31.6 LED14.C 10.45,31.05 6.3,31.05 5.93,30.68 LED3.A 3.98,30.68 2.3,29 2.3,27.15 2.55,26.9 2.55,25.5 LED4.C 1.2,24.15 1.2,22.55 1.75,22 2.25,22 3.05,21.2 3.05,20.45 2.9,20.3 2.9,16.35 3.95,15.3 v4.2,15.3 | LED12.A 24.72,30.68 | LED11.C 28.15,25.5 28.15,26.9 24.37,30.68 LED12.A
  Bottom 0.15: R5.2 3.55,12.8 3.55,14.65 v4.2,15.3
N$10  (via drill 0.3)
  Top 0.15: 5.8,31.8 LED3.C 5.27,31.82 5.05,31.6 4.4,31.6 1.95,29.15 1.95,26.5 LED4.A 0.85,25.4 0.85,20.2 LED5.C 2.55,18.5 2.55,16.2 3.55,15.2 3.55,14.9 v4.15,14.3 4.15,13.65 LED6.A | 23.25,12.12 LED10.C 24.48,12.08 25.45,13.05 25.45,14.95 26.8,16.3 26.8,17.25 LED9.A 28.15,18.6 28.15,20.1 26.45,21.8 26.45,24.85 25.7,25.6 25.7,26.6 24.8,27.5 24.8,28.5 22.05,31.25 19.65,31.25 18.85,30.45 17.9,30.45 17.55,30.1 15.5,30.1 15.15,30.45 12.45,30.45 12,30 6.6,30 6.25,29.65 5.85,29.65 4.35,28.15 4.35,26.65 3.6,25.9 3.6,25.2 4.1,24.7 4.1,19.95 3.95,19.8 3.95,17.95 v4.2,17.7
  Bottom 0.15: R7.2 4.61,13.84 v4.15,14.3 4.85,15 4.85,15.8 4.55,16.1 4.55,17.1 4.2,17.45 v4.2,17.7
N$11  (via drill 0.3)
  Top 0.15: LED7.A 13.4,9.2 12.55,8.35 11.45,8.35 11,8.8 10.65,8.8 LED8.C 9.55,8.5 9.55,6.9 9.8,6.65 9.8,6 9.45,5.65 8.55,5.65 v8.45,5.75 8.45,6.35 8.85,6.75 8.85,9.4 6.2,12.05 5.75,12.05 LED6.C 4.52,12.08 3.5,13.1 3.5,14.4 v2.95,14.95 2.95,15.3 2.2,16.05 2.2,17.25 LED5.A | v3.9,16.7 3.6,17 3.6,20 3.75,20.15 3.75,24.55 3.25,25.05 3.25,26.05 4,26.8 4,28.3 5.7,30 6.15,30 6.5,30.35 11.85,30.35 12.3,30.8 15.35,30.8 15.7,30.45 17.45,30.45 17.8,30.8 18.75,30.8 19.55,31.6 21.8,31.6 22.02,31.82 LED12.C | LED12.C 23.18,30.62 25.15,28.65 25.15,27.65 25.45,27.35 26.2,27.35 LED11.A | 23.17,31.8 LED12.C
  Bottom 0.15: R8.2 9.06,5.14 v8.45,5.75 | v2.95,14.95 2.95,15.75 v3.9,16.7
N$12  (via drill 0.3)
  Top 0.15: v9.2,6.25 9.2,9.8 | LED7.C 17.9,10.05 16.45,10.05 15.95,9.55 12.2,9.55 LED8.A 11,10.05 9.45,10.05 9.2,9.8 | LED10.A 24.42,14.37 26.45,16.4 26.45,18.5 LED9.C 26.45,20.2 v26.45,20.55 | 9.2,9.8 4.8,14.2 4.8,15.55 4.35,16 3.75,16 3.25,16.5 3.25,20.15 3.4,20.3 3.4,24.4 2.9,24.9 2.9,26.2 3.65,26.95 3.65,28.45 5.55,30.35 6.05,30.35 6.4,30.7 11.7,30.7 LED14.A 12.95,31.15 15.55,31.15 15.9,30.8 17.3,30.8 LED13.C 18.45,31.95 21.55,31.95 v22.1,32.5
  Bottom 0.15: v9.2,6.25 9.71,5.74 R9.2 | v26.45,20.55 25.65,20.55 24.95,21.25 24.95,29.8 23.4,31.35 23.4,31.9 22.8,32.5 v22.1,32.5
N$13  (via drill 0.3)
  Top 0.15: v24,20.45 24,22.8 22.9,23.9 22.05,23.9 21.75,24.2 v21.75,25.9
  Bottom 0.15: R4.2 24,19.93 v24,20.45 | JP1.P$2 11.35,40.04 11.35,33.1 12.3,32.15 16.5,32.15 17.85,30.8 19.25,30.8 19.95,30.1 19.95,29.1 21.75,27.3 v21.75,25.9
N$14  (via drill 0.3)
  Top 0.15: v24.9,20.45 24.9,23.15 23.5,24.55 v22.35,24.55
  Bottom 0.15: R6.2 24.9,20.13 v24.9,20.45 | JP1.P$3 13.85,40.08 13.85,32.95 14.3,32.5 16.65,32.5 18,31.15 19.35,31.15 20.3,30.2 20.3,29.3 22.45,27.15 22.45,24.65 v22.35,24.55
N$31
  Bottom 0.15: U6.10 17.05,29.25 17.58,29.78 C12.1
N$33
  Bottom 0.15: U6.20 11.37,28.75 C8.1
RXD
  Bottom 0.15: U4.30 17.51,7.29 17.6,7.2 18.45,7.2 19.2,7.95 19.2,9.85 24.1,14.75 24.1,17.37 R6.1
SCL  (via drill 0.3)
  Top 0.15: U1.10 15.3,4.4 15.6,4.7 15.6,5.1 16.7,6.2 19.15,6.2 19.6,6.65 19.6,9.75 18.75,10.6 16,10.6 14.2,12.4 v13.9,12.4 15,13.5 17.3,13.5 19.57,15.77 R2.1 19.57,18.58 19.15,19 19.15,19.55 18.06,20.64 v17.25,20.64 16.57,19.97 B1.11
  Bottom 0.15: U6.23 11.3,30.25 10.6,29.55 10.6,27.6 9.6,26.6 9.6,25.95 10.35,25.2 11.45,25.2 12.2,24.45 13.55,24.45 14.25,23.75 14.25,23.1 15.1,22.25 15.1,21.65 16.11,20.64 v17.25,20.64 | U4.19 13.74,11.01 13.6,11.15 13.6,12.1 v13.9,12.4
SDA  (via drill 0.3)
  Top 0.15: v14.2,11.55 9.65,11.55 v9.35,11.85
  Bottom 0.15: v9.35,11.85 7.95,11.85 5.95,13.85 5.95,16.85 6.5,17.4 6.5,19.95 5.95,20.5 5.95,21.9 6.42,22.38 U$1.1 | U4.20 14.25,11.5 v14.2,11.55
SWCLK  (via drill 0.3)
  Top 0.15: v19.35,12.25 19.35,13.1 22.4,16.15 24,16.15 v25.45,17.6
  Bottom 0.15: 27.31,18 P11.PIN 25.77,17.92 v25.45,17.6 | U4.24 16.91,10.51 17.55,11.15 17.55,11.4 18.4,12.25 v19.35,12.25
SWDIO  (via drill 0.3)
  Top 0.15: v20.6,13.5 22.85,15.75 v24.85,15.75
  Bottom 0.15: U4.23 15.75,10.89 16.05,11.2 16.85,11.2 18.5,12.85 19.95,12.85 v20.6,13.5 | P12.PIN 26.25,15.75 v24.85,15.75
TXD
  Bottom 0.15: U4.29 17.5,7.8 17.75,7.55 18.35,7.55 18.85,8.05 18.85,9.95 23.75,14.85 23.75,18.12 R4.1
VDD  (via drill 0.3)
  Top 0.15: R2.2 21.05,18.02 v21.05,18.65
  Top 0.5: B1.2 13.6,19.4 12.95,20.05 12.2,20.05 v12,19.85
  Bottom 0.15: U4.5 14.25,5.05 14.05,4.85 13.8,4.85 v13.55,4.6 | C1.1 6.9,14.35 v6.65,14.6 6.42,14.82 U$1.24 | U$2.24 15.43,15.07 15.05,14.7 v15.05,14.15 15.57,14.15 C5.1 | C14.1 18.02,5.55 v17,5.55 16.96,5.59 U4.1 | U4.17 12.75,11.73 C13.1 12.73,12.52 v12.65,12.6 | v24.85,11.45 24.85,11.87 P10.PIN | U6.13 15.75,26.9 15.9,26.75 17.57,26.75 C3.1 18.98,28 v19.5,28 | U6.9 17.1,29.75 17.35,30 | U6.8 17.1,30.25 17.35,30 | 17.35,30 17.7,30.35 18.85,30.35 19.25,29.95 v19.25,29.35
  Bottom 0.5: IC2.5 C4.1 | C4.1 | C4.1 v25.8,21.3
  pour Route3: 3.9,-2.2 25.4,-1.65 34.35,25.5 25.5,25.5 21.5,29.5 8.5,29.5 5,25.5 -4.1,25.5
VEE  (via drill 0.3)
  Top 0.15: U1.11 16.2,3.8 16.65,3.35 16.65,2.65 16.2,2.2 U1.1 16.14,2.14 15.6,1.6 13.4,1.6 12.9,2.1 U1.5
  Top 0.4: C2.1 17.02,4.65 v16.35,4.65 16.35,4.05 U1.11
  Top 0.5: v5.75,19.65 5.75,18.7 6.65,17.8 7.75,17.8 8.5,18.55 10.95,18.55 11.45,19.05 12.5,19.05 v12.65,19.2 12.9,18.95 12.9,18.55 13.12,18.34 B1.3
  Route3 0.3: v16.35,4.65 15.2,3.5 13.05,3.5 9.6,6.95 9.6,9.6 7.2,12 v7.2,13.45 6.2,13.45 5.75,13.9 v5.75,19.65
  Bottom 0.15: R3.2 7.35,13.3 v7.2,13.45
  Bottom 0.5: v5.75,19.65 5.45,19.95 5.45,25.3 6.3,26.15 C6.1 IC1.5

### Text on the board
tPlace: V1.1 | SSSLidar | PWR | X | B | Y | Z | SIG | SIG | C | PWR | A | 3
bPlace: DXLD | X | Y | Z | 20160910 | C | G | I | !R | 2 | V | 1